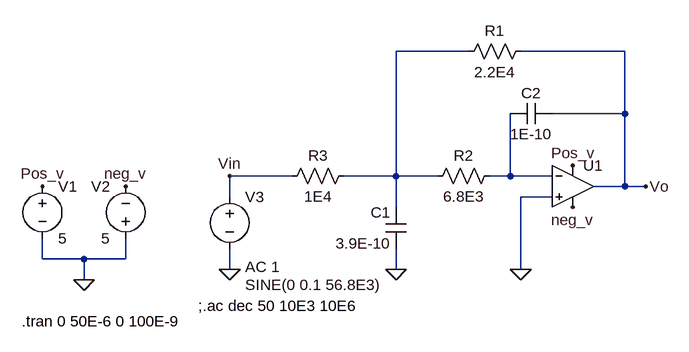
[diagram p0: schematic 2nd order E6.asc]
2nd order E6.asc, the LTspice schematic file:
Version 4
SHEET 1 880 680
WIRE 304 -144 192 -144
WIRE 544 -144 384 -144
WIRE 544 -48 544 -144
WIRE 544 -48 432 -48
WIRE 32 48 -64 48
WIRE 192 48 192 -144
WIRE 192 48 112 48
WIRE 256 48 192 48
WIRE 368 48 368 -48
WIRE 368 48 336 48
WIRE 432 48 368 48
WIRE 544 64 544 -48
WIRE 544 64 496 64
WIRE 576 64 544 64
WIRE -64 80 -64 48
WIRE 432 80 384 80
WIRE 192 96 192 48
WIRE -352 176 -352 144
WIRE -288 176 -352 176
WIRE -224 176 -224 144
WIRE -224 176 -288 176
WIRE -64 192 -64 160
WIRE 192 192 192 160
WIRE 384 192 384 80
WIRE -288 208 -288 176
FLAG -352 64 Pos_v
FLAG -224 64 neg_v
FLAG -288 208 0
FLAG 384 192 0
FLAG 192 192 0
FLAG -64 192 0
FLAG 464 32 Pos_v
FLAG 464 96 neg_v
FLAG 576 64 Vo
FLAG -64 48 Vin
SYMBOL voltage -352 48 R0
WINDOW 123 0 0 Left 0
WINDOW 39 0 0 Left 0
SYMATTR InstName V1
SYMATTR Value 5
SYMBOL voltage -224 160 R180
WINDOW 0 24 96 Left 2
WINDOW 3 24 16 Left 2
SYMATTR InstName V2
SYMATTR Value 5
SYMBOL Opamps\\UniversalOpamp2 464 64 R0
SYMATTR InstName U1
SYMATTR Value2 Avol=1Meg GBW=1Meg Slew=10Meg
SYMBOL res 400 -160 R90
WINDOW 0 0 56 VBottom 2
WINDOW 3 32 56 VTop 2
SYMATTR InstName R1
SYMATTR Value 2.2E4
SYMBOL res 352 32 R90
WINDOW 0 0 56 VBottom 2
WINDOW 3 32 56 VTop 2
SYMATTR InstName R2
SYMATTR Value 6.8E3
SYMBOL res 128 32 R90
WINDOW 0 0 56 VBottom 2
WINDOW 3 32 56 VTop 2
SYMATTR InstName R3
SYMATTR Value 1E4
SYMBOL cap 208 160 R180
WINDOW 0 24 56 Left 2
WINDOW 3 24 8 Left 2
SYMATTR InstName C1
SYMATTR Value 3.9E-10
SYMBOL cap 368 -32 R270
WINDOW 0 32 32 VTop 2
WINDOW 3 0 32 VBottom 2
SYMATTR InstName C2
SYMATTR Value 1E-10
SYMBOL voltage -64 64 R0
WINDOW 123 24 124 Left 2
WINDOW 39 0 0 Left 0
WINDOW 3 24 152 Left 2
SYMATTR Value2 AC 1
SYMATTR InstName V3
SYMATTR Value SINE(0 0.1 56.8E3)
TEXT -112 248 Left 2 !;.ac dec 50 10E3 10E6
TEXT -384 272 Left 2 !.tran 0 50E-6 0 100E-9

The netlist it stands for:
* 2nd order E6.asc
V1 Pos_v 0 5
V2 0 neg_v 5
XU1 0 N002 Pos_v neg_v Vo level.2 Avol=1Meg GBW=1Meg Slew=10Meg ilimit=25m rail=0 Vos=0 phimargin=45 en=0 enk=0 in=0 ink=0 Rin=500Meg  ; pins IN+ IN- V+ V- OUT
R1 Vo N001 2.2E4
R2 N002 N001 6.8E3
R3 N001 Vin 1E4
C1 0 N001 3.9E-10
C2 N002 Vo 1E-10
V3 Vin 0 SINE(0 0.1 56.8E3) AC 1
;.ac dec 50 10E3 10E6
.tran 0 50E-6 0 100E-9
.lib UniversalOpamps2.sub
.backanno
.end

* Results of the author's LTspice run, read from the files saved beside the schematic
* Operating Point, zero values left out:
*   V(pos_v) = 5 V
*   V(neg_v) = -5 V
*   I(V2) = -500 µA
*   I(V1) = -500 µA
*   Ix(u1:3) = 500 µA
*   Ix(u1:4) = -500 µA
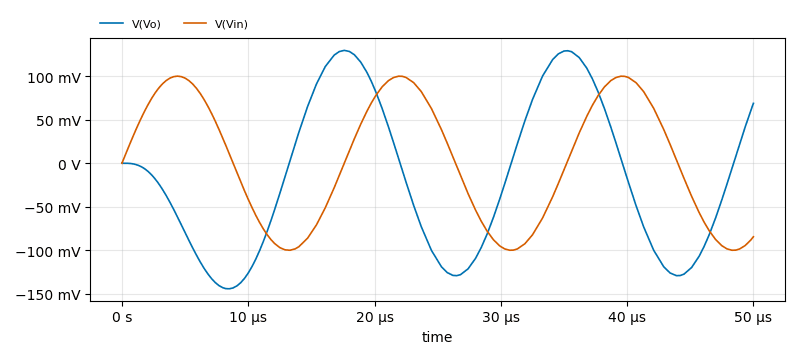
[diagram p1: Transient Analysis of 2nd order E6.asc, plotted from the saved traces]
* Transient Analysis, 1 run:
*   V(Vo): min -144.2 mV, max 129.6 mV, average -18.44 mV, rms 89.94 mV, last 68.78 mV
*   V(Vin): min -99.93 mV, max 100 mV, average 2.604 mV, rms 71.61 mV, last -84.43 mV